# Altium schematic sheet ArduinoZero.SchDoc
size A
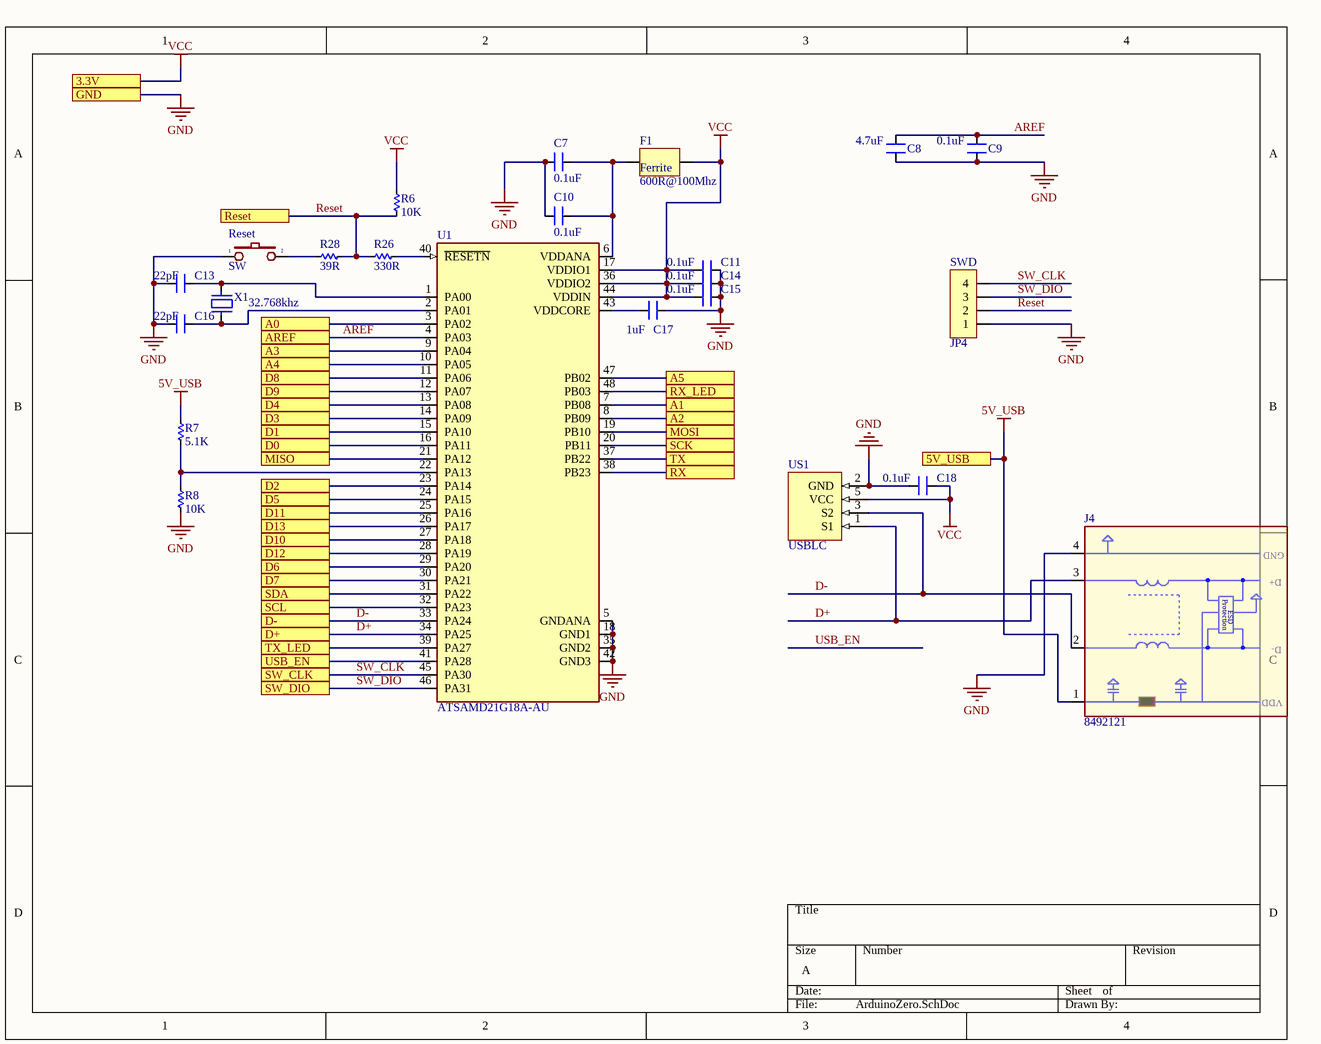
[diagram p0: ArduinoZero.SchDoc]

## Parts
C7  0.1uF  [CN-SMD-0603_big]
C8  4.7uF  [CN-SMD-0603_big]
C9  0.1uF  [CN-SMD-0603_big]
C10  0.1uF  [CN-SMD-0603_big]
C11  0.1uF  [CN-SMD-0603_big]
C13  22pF  [CN-SMD-0603_big]
C14  0.1uF  [CN-SMD-0603_big]
C15  0.1uF  [CN-SMD-0603_big]
C16  22pF  [CN-SMD-0603_big]
C17  1uF  [CN-SMD-0603_big]
C18  0.1uF  [CN-SMD-0603_big]
F1  600R@100Mhz  [Capacitor_805]
J4  8492121  [USB-C3]
R6  10K  [RES-SMD-0603_BIG]
R7  5.1K  [RES-SMD-0603_BIG]
R8  10K  [RES-SMD-0603_BIG]
R26  330R  [RES-SMD-0603_BIG]
R28  39R  [RES-SMD-0603_BIG]
Reset  SW  [SW1-SMD]
SWD  JP4  [JP4-D1C]
U1  ATSAMD21G18A-AU  [QFP50P900X900X120-48N]
US1  USBLC  [SOT23-6]
X1  32.768khz  [XT32k]

## Ports
3.3V, 5V_USB, A0, A1, A2, A3, A4, A5, AREF, D0, D1, D2, D3, D4, D5, D6, D7, D8, D9, D10, D11, D12, D13, D+, D-, GND, MISO, MOSI, Reset, RX, RX_LED, SCK, SCL, SDA, SW_CLK, SW_DIO, TX, TX_LED, USB_EN

## Nets
5V_USB: J4.1(VBUS) R7.1 ; port 5V_USB
GND: C7.2 C8.1 C9.1 C10.2 C11.2 C13.1 C14.2 C15.2 C16.1 C17.2 C18.1 J4.4(GND) R8.2 Reset.1 SWD.1 U1.5(GNDANA) U1.18(GND1) U1.35(GND2) U1.42(GND3) US1.2(GND) ; port GND
VCC: C11.1 C14.1 C15.1 C18.2 F1.2 R6.1 U1.17(VDDIO1) U1.36(VDDIO2) U1.44(VDDIN) US1.5(VCC) ; port 3.3V
A0: U1.3(PA02) ; port A0
A1: U1.7(PB08) ; port A1
A2: U1.8(PB09) ; port A2
A3: U1.9(PA04) ; port A3
A4: U1.10(PA05) ; port A4
A5: U1.47(PB02) ; port A5
AREF: C8.2 C9.2 U1.4(PA03) ; port AREF
D0: U1.16(PA11) ; port D0
D1: U1.15(PA10) ; port D1
D2: U1.23(PA14) ; port D2
D3: U1.14(PA09) ; port D3
D4: U1.13(PA08) ; port D4
D5: U1.24(PA15) ; port D5
D6: U1.29(PA20) ; port D6
D7: U1.30(PA21) ; port D7
D8: U1.11(PA06) ; port D8
D9: U1.12(PA07) ; port D9
D10: U1.27(PA18) ; port D10
D11: U1.25(PA16) ; port D11
D12: U1.28(PA19) ; port D12
D13: U1.26(PA17) ; port D13
D+: J4.3(D+) U1.34(PA25) US1.1(S1) ; port D+
D-: J4.2(D-) U1.33(PA24) US1.3(S2) ; port D-
MISO: U1.21(PA12) ; port MISO
MOSI: U1.19(PB10) ; port MOSI
Reset: R6.2 R26.1 R28.2 SWD.2 ; port Reset
RX: U1.38(PB23) ; port RX
RX_LED: U1.48(PB03) ; port RX_LED
SCK: U1.20(PB11) ; port SCK
SCL: U1.32(PA23) ; port SCL
SDA: U1.31(PA22) ; port SDA
SW_CLK: SWD.4 U1.45(PA30) ; port SW_CLK
SW_DIO: SWD.3 U1.46(PA31) ; port SW_DIO
TX: U1.37(PB22) ; port TX
TX_LED: U1.39(PA27) ; port TX_LED
USB_EN: U1.41(PA28) ; port USB_EN
NetC7_1: C7.1 C10.1 F1.1 U1.6(VDDANA)
NetC13_2: C13.2 U1.1(PA00) X1.2
NetC16_2: C16.2 U1.2(PA01) X1.1
NetC17_1: C17.1 U1.43(VDDCORE)
NetR7_2: R7.2 R8.1 U1.22(PA13)
NetR26_2: R26.2 U1.40(~{RESETN})
NetR28_1: R28.1 Reset.2

## Notes on the sheet
- (in symbol USB-4) Protection; ESD; VDD

## Library data of the parts
C7-C11 C13-C18 = CN: Value: 33pF
F1 = Ferrite
J4 = USB-4: THT USB 2.0 A Connector WE-EPLE; Manufacturer: Würth Elektronik eiSos GmbH; PartNo: 8492121; ComponentLink1Description: Manufacturer; ComponentLink1URL: http://www.we-online.de; Created by: Christin Otto; Created Date: OCT-2014; ComponentLink2Description: Datasheet; ComponentLink2URL: http://www.we-online.de/katalog/media/pdf/8492121.pdf
R6-R8 R26 R28 = R
Reset = SW2: Switch button 2 pin; Value: SW chip 2 pin
SWD = JP4: WR-PHD 2.54 mm Angled Socket Header; Manufacturer: W¨¹rth Elektronik eiSos GmbH; partNo: 613004143121; ComponentLink1 Description: Manufacturer; ComponentLink2 Description: Datasheet; NoPins: 04; Created Date: 29 March 2013; ComponentLink1URL: http://www.we-online.com; ComponentLink2URL: http://katalog.we-online.de/em/datasheet/6130xx143121.pdf; Created by: Karrer Zheng
U1 = ATSAMD21G18A-AU: ARMÂ® CortexÂ®-M0+ SAM D21G Microcontroller IC 32-Bit 48MHz 256KB _256K x 8_ FLASH 48-TQFP _7x7_ / Arduino Zero; MF: Microchip; MP: ATSAMD21G18A-AU; Price: None; Package: TQFP-48 Atmel; Value: *; Availability: Unavailable; SnapEDA_Link: https://www.snapeda.com/parts/ATSAMD21G18A-AU/Microchip/view-part/55502/?ref=snap
US1 = USBLC6-2S: http://robocon.vn/detail/ic81-ic-dan-ul26-usblc6-2sc6-sot-23-6-st-st-esd.html
X1 = XT2: Crystal, 32.768 KHz, -40 to 85 degC, 3.2 x 1.5 x 0.9 mm SMD; Value: 4Mhz